# EAGLE design openSX70-dongle_v6-3-dual-led (EAGLE 9.2.2)
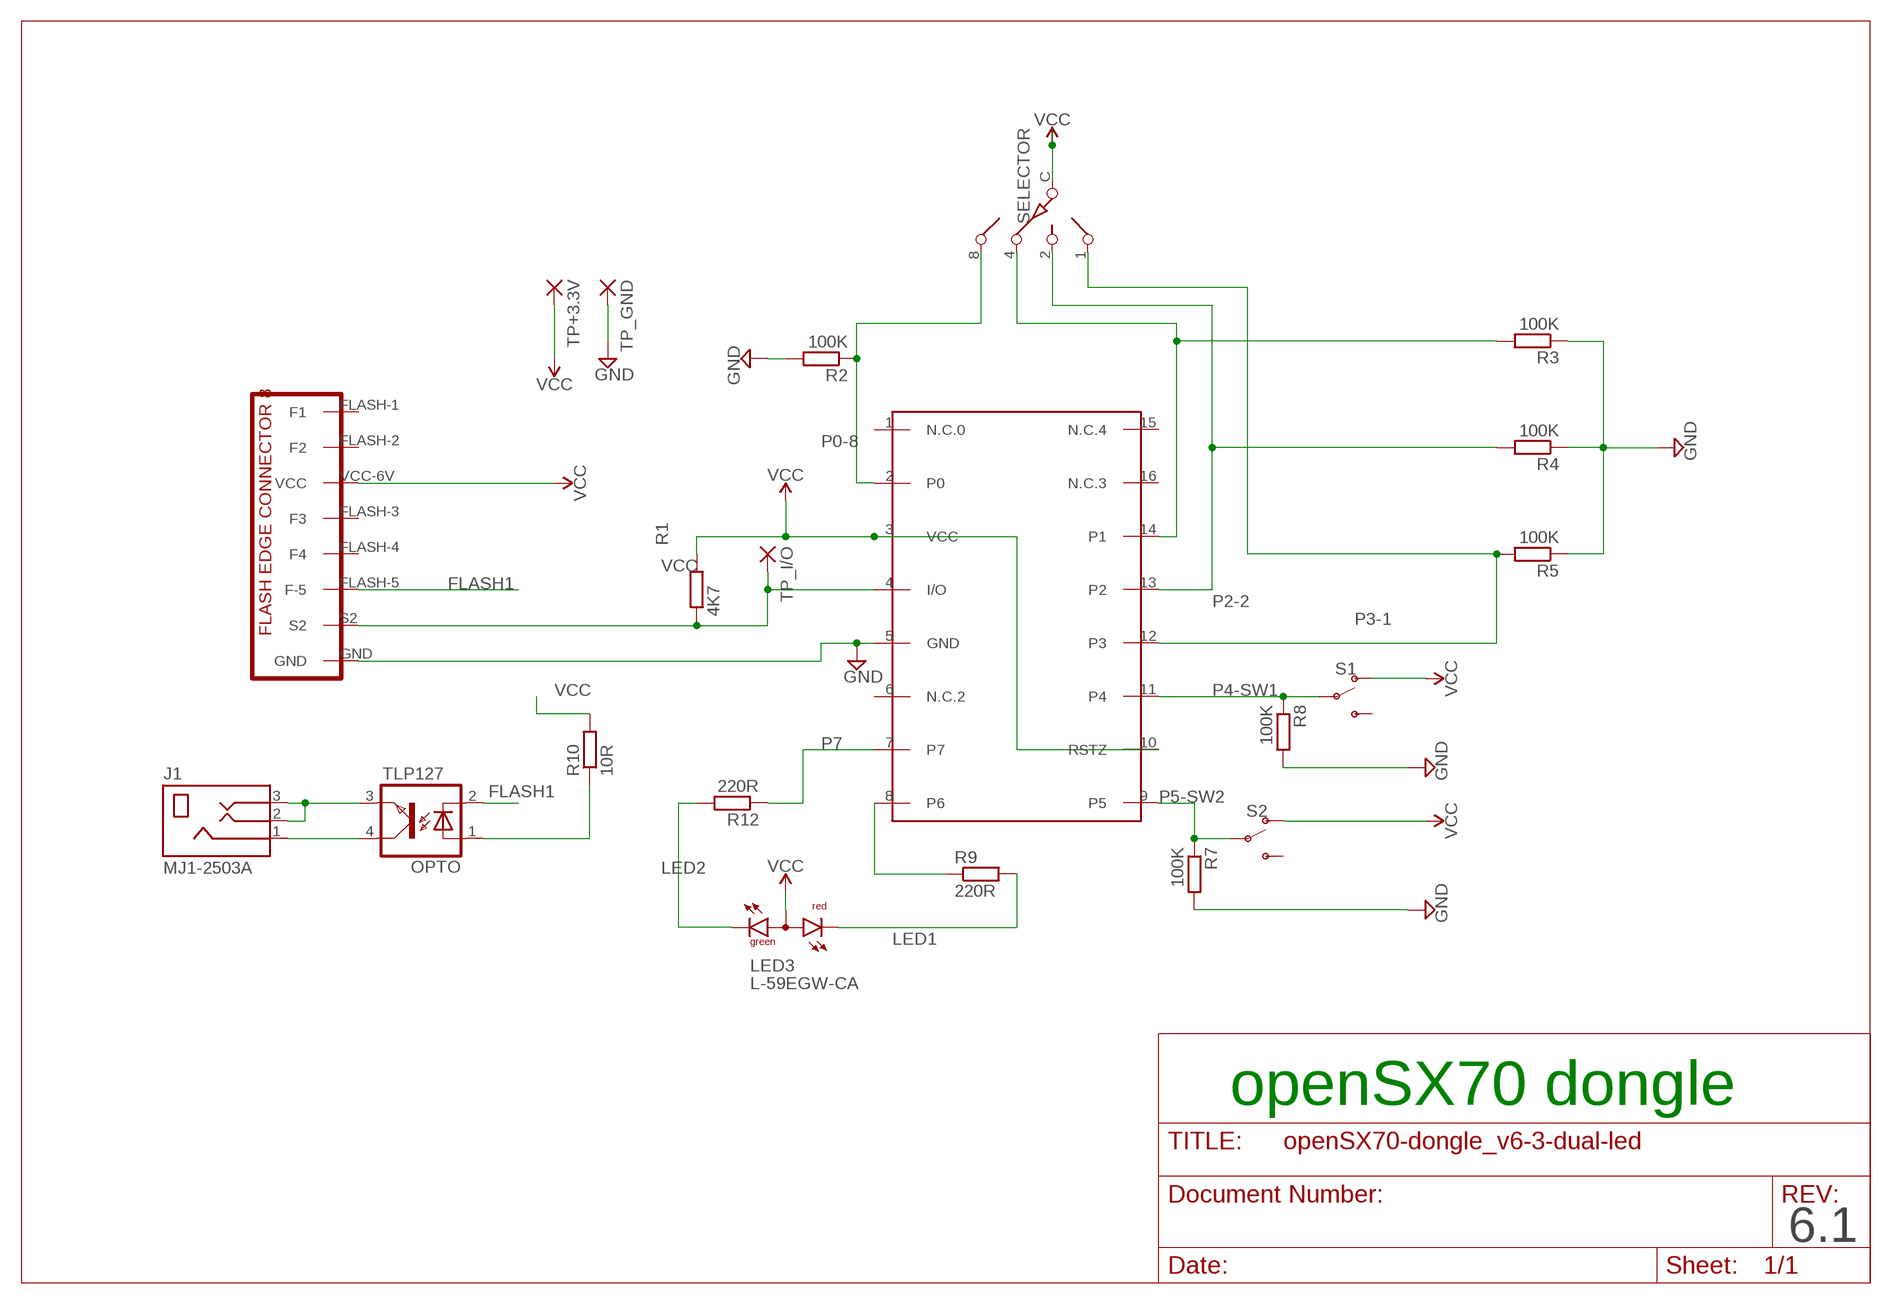
[diagram p0: schematic, sheet 1]

## Parts
DS2408  DS2408  [SO16]
J1  MJ1-2503A  [CUI_MJ1-2503A]
LED3  L-59EGW-CA  [L-59EGW-CA]
OPTO  TLP127  [SO-4]
R1  4K7  R-EU_R0603  [R0603]
R2  100K  R-EU_R0603  [R0603]
R3  100K  R-EU_R0603  [R0603]
R4  100K  R-EU_R0603  [R0603]
R5  100K  R-EU_R0603  [R0603]
R7  100K  R-EU_R0603  [R0603]
R8  100K  R-EU_R0603  [R0603]
R9  220R  R-EU_R0603  [R0603]
R10  10R  R-EU_R0603  [R0603]
R12  220R  R-EU_R0603  [R0603]
S1  SWITCH-SPDT-SMD-RIGHT-ANGLE  [SWITCH_SPST_SMD_A]
S2  SWITCH-SPDT-SMD-RIGHT-ANGLE  [SWITCH_SPST_SMD_A]
SELECTOR  SW-C16  [SW-C16]
TP+3.3V  SMD2  [SMD1,27-2,54]
TP_GND  SMD2  [SMD1,27-2,54]
TP_I/O  SMD2  [SMD1,27-2,54]
U$2  SX70-FLASH-EDGE8-MALE-PROPER  [SX70-FLASH-EDGE8]

## Nets
FLASH1: OPTO.2(C) U$2.FLASH-5(F-5)
GND: DS2408.5(GND) R2.2 R3.1 R4.1 R5.1 R7.2 R8.2 TP_GND.1(P) U$2.GND
LED1: LED3.1(CR) R9.2
LED2: LED3.3(CG) R12.2
N$9: J1.1 OPTO.4(COL)
N$12: OPTO.1(A) R10.1
N$15: J1.2 J1.3 OPTO.3(EMIT)
P0-8: DS2408.2(P0) R2.1 SELECTOR.8
P1-4: DS2408.14(P1) R3.2 SELECTOR.4
P2-2: DS2408.13(P2) R4.2 SELECTOR.2
P3-1: DS2408.12(P3) R5.2 SELECTOR.1
P4-SW1: DS2408.11(P4) R8.1 S1.2(P)
P5-SW2: DS2408.9(P5) R7.1 S2.2(P)
P6: DS2408.8(P6) R9.1
P7: DS2408.7 R12.1
S2+: DS2408.4(I/O) R1.1 TP_I/O.1(P) U$2.S2
VCC: DS2408.3(VCC) DS2408.10(RSTZ) LED3.2(A) R1.2 R10.2 S1.1(O) S2.1(O) SELECTOR.C TP+3.3V.1(P) U$2.VCC-6V(VCC)
Unconnected: DS2408.1(N.C.0) DS2408.6(N.C.2) DS2408.15(N.C.4) DS2408.16(N.C.3) S1.3(S) S2.3(S) U$2.FLASH-1(F1) U$2.FLASH-2(F2) U$2.FLASH-3(F3) U$2.FLASH-4(F4)

## Notes on the sheet
- openSX70 dongle
- 6.1

## Library data of the parts
DS2408 = DS2408-joaco:DS2408
J1 = MJ1-2503A:MJ1-2503A: 2.5 mm, Mono, Right Angle, Through Hole, Audio Jack Connector; CUI_PURCHASE_URL: https://www.cui.com/product/interconnect/connectors/audio-connectors/jacks/mj1-2503a?utm_source=snapeda.com&utm_medium=referral&utm_campaign=snapedaBOM; DESCRIPTION: 2.5 mm, Mono, Right Angle, Through Hole, Audio Jack Connector; DIGI-KEY_PART_NUMBER: CP1-2503AM-ND; DIGI-KEY_PURCHASE_URL: https://www.digikey.com/product-detail/en/cui-inc/MJ1-2503A/CP1-2503AM-ND/738679?utm_source=snapeda&utm_medium=aggregator&utm_campaign=symbol; MF: CUI Inc.; MP: MJ1-2503A; PACKAGE: None
LED3 = led:L-59EGW-CA: T-1 3/4 (5mm) BI-COLOR INDICATOR LAMP Source: http://www.kingbright.com/manager/upload/pdf/L-59EGW-CA%28Ver1292805989.13%29
OPTO = openSX70:TLP127
R1-R5 R7-R9 R12 = rcl:R-EU_: RESISTOR, European symbol; SPICEPREFIX: R
R10 = resistor:R-EU_: RESISTOR, European symbol
S1 S2 = SparkFun-Switches:SWITCH-SPDT: Single Pole, Double Throw (SPDT) Switch Single-pole, double-throw (SPDT) switch. Variant Overview SMD-AYZ0202 Surface Mount DPDT Switch <https://www.sparkfun.com/products/597> (COM-00597) Used on e.g. LilyPad Arduino USB - ATmega32U4 Board <https://www.sparkfun.com/products/12049> PTH-11.6X4.0MM SPDT Mini Power Switch <https://www.sparkfun.com/products/102> (COM-00102) Used on e.g. SparkFun Simon Says - Through-Hole Soldering Kit <https://www.sparkfun.com/products/10547> (KIT-10547) PTH-11.6X4.0MM-KIT KIT version of SPDT Mini Power Switch - Simplifies soldering by removing tStop of switch pins - only one side can be soldered. PTH-11.6X4.0MM-LOCK LOCK version of SPDT Mini Power Switch - Offset pins hold switch in place for easier soldering. SMD-RIGHT-ANGLE Surface Mount Right Angle Switch <https://www.sparkfun.com/products/10860> (COM-10860) Used on e.g. SparkFun ESP8266 Thing <https://www.sparkfun.com/products/13231>; PROD_ID: SWCH-10651; SF_SKU: COM-10860
SELECTOR = special:SW-C16: SWITCH 16-step rotary switch
TP+3.3V TP_GND TP_I/O = wirepad:SMD2: SMD PAD
U$2 = _openSX70:SX70-FLASH-EDGE8-MALE-PROPER

## Net classes
0 GND: width 0.305 mm
1 VCC: width 0.254 mm
2 2.8V: width 0.254 mm

## Board
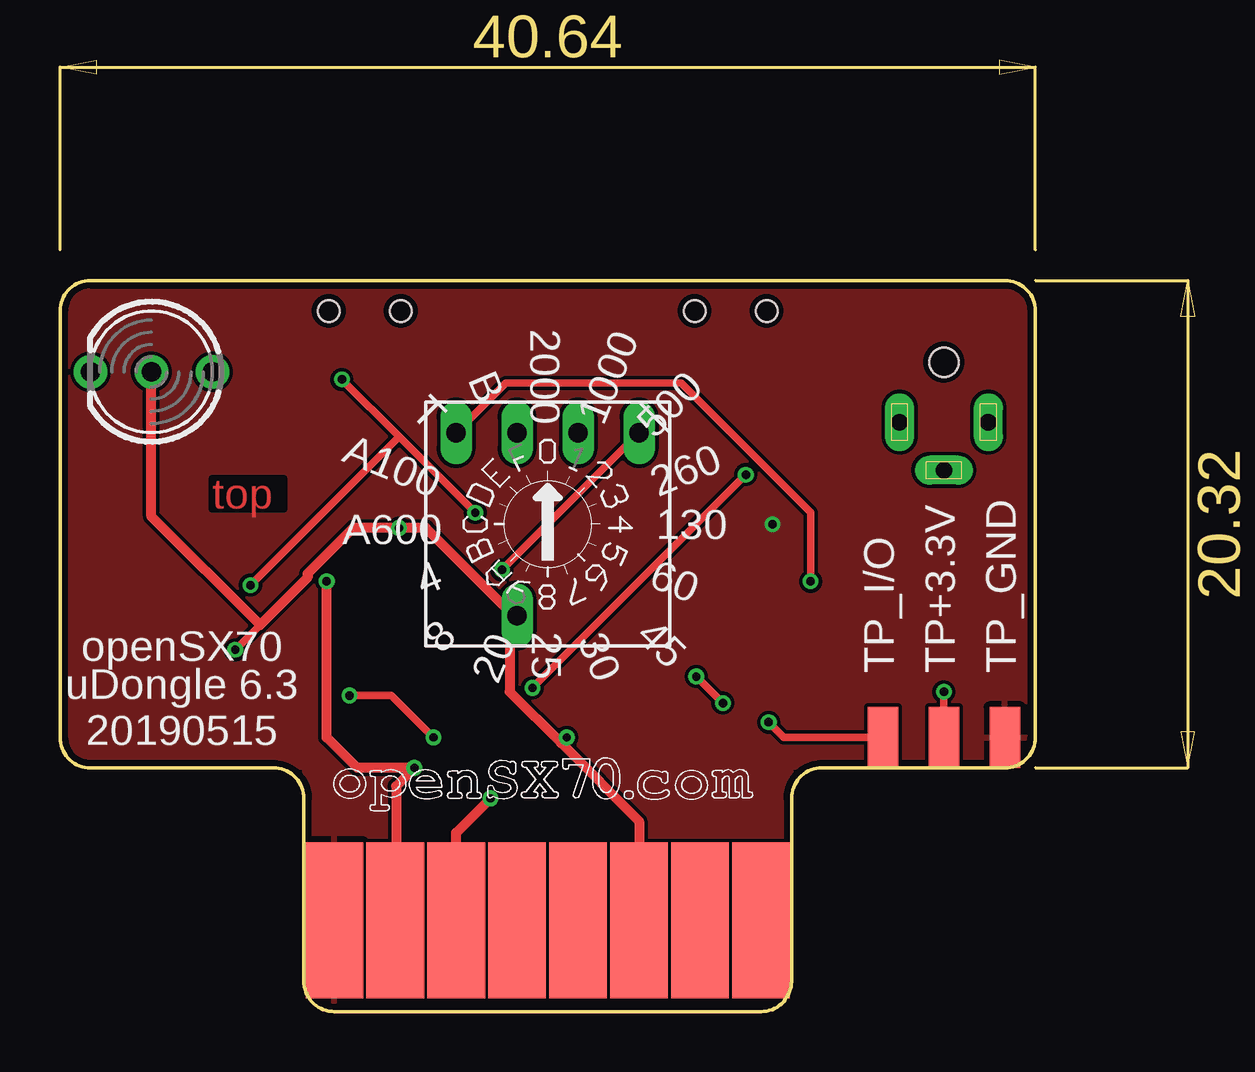
[diagram p1: board, top side]
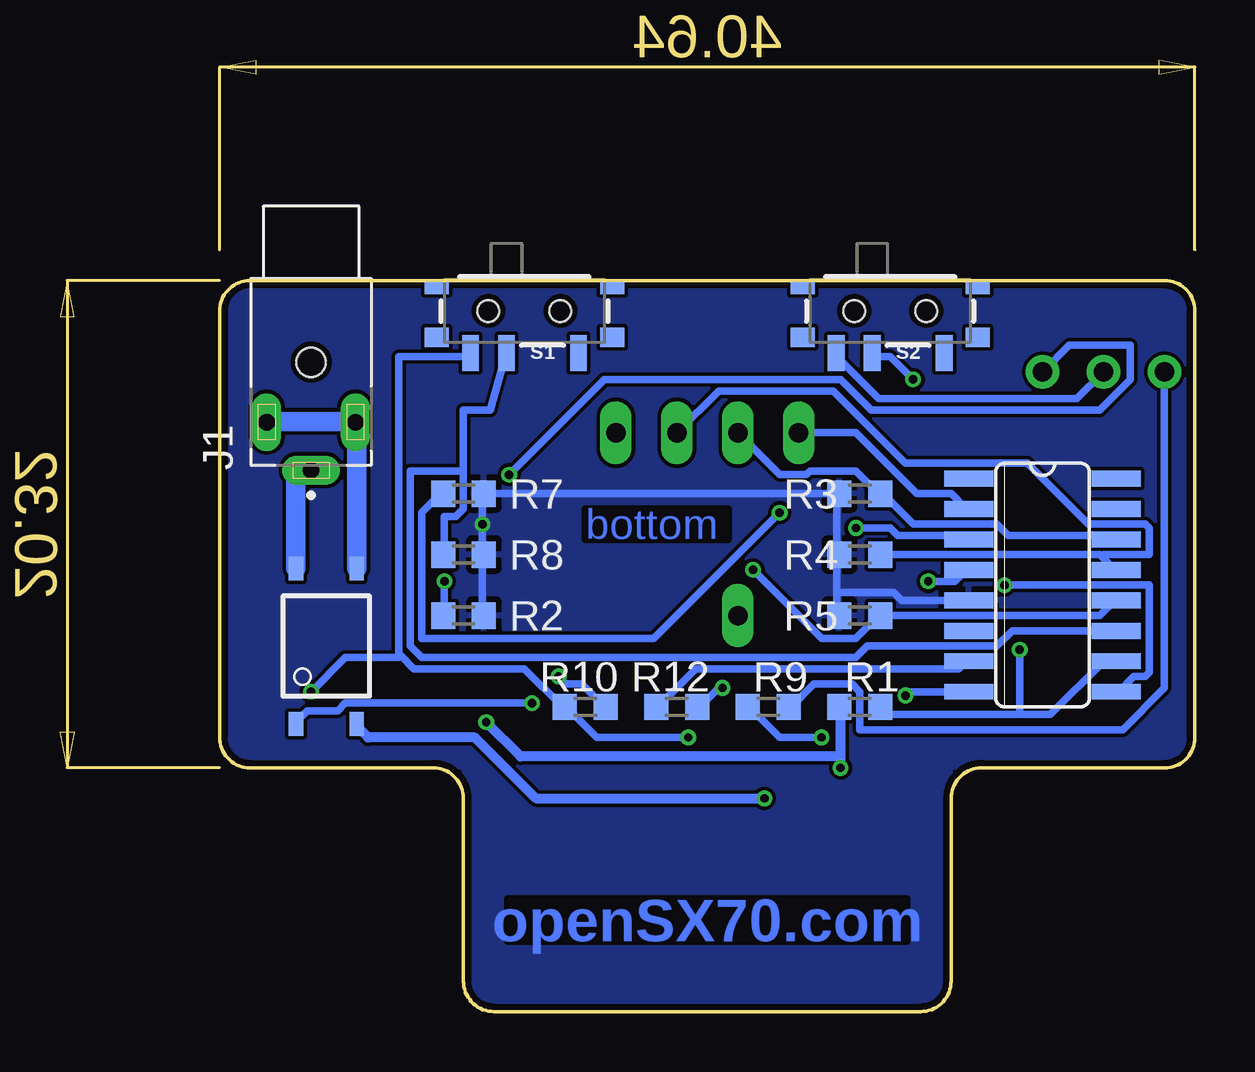
[diagram p2: board, bottom side, seen from below]

Size 40.64 x 30.48 mm. Coordinates in mm from the lower left corner, seen from the top.
Outline: 1.27,30.48 39.37,30.48 arc-90 40.64,29.21 40.64,11.43 arc-90 39.37,10.16 31.75,10.16 arc90 30.48,8.89 30.48,1.27 arc-90 29.21,0 11.43,0 arc-90 10.16,1.27 10.16,8.89 arc90 8.89,10.16 1.27,10.16 arc-90 0,11.43 0,29.21 arc-90 1.27,30.48
Copper layers (1*16): Top 0.035mm / dielectric 1.5mm / Bottom 0.035mm
Design rules "SeeedStudio_2layer_DRU_no_angle_20140221": minimum track width 6mil, minimum drill 12mil, track to track 6mil, track to pad 6mil, pad to pad 6mil, via to via 6mil, smd to smd 0mil, copper to edge 10mil, drill to drill 10mil, minimum pad ring 10mil, minimum via ring 6mil, stop-mask expansion 2mil, vias tented up to drill 100mil, thermal gap 10mil

### Footprints (pad centres in the part's own frame; a part is rotated, then mirrored left to right if it is on the bottom)
SO16 = smd 0.66 x 2.032: 1 -4.445,-3.073; 2 -3.175,-3.073; 3 -1.905,-3.073; 4 -0.635,-3.073; 5 0.635,-3.073; 6 1.905,-3.073; 7 3.175,-3.073; 8 4.445,-3.073; 9 4.445,3.073; 10 3.175,3.073; 11 1.905,3.073; 12 0.635,3.073; 13 -0.635,3.073; 14 -1.905,3.073; 15 -3.175,3.073; 16 -4.445,3.073
CUI_MJ1-2503A = drill 0.7 long: 1 -4.1,0; 2 -2.1,1.85; 3 -2.1,-1.85 | hole 1.2: 0.4,0
L-59EGW-CA = drill 0.8 pad 1.4: 1 0,2.54; 2 0,0; 3 0,-2.54
SO-4 = smd 1 x 0.6: 1 -3.24,0.635; 2 -3.24,-1.905; 3 3.24,-1.905; 4 3.24,0.635
R0603 = smd 1 x 1.1: 1 -0.85,0; 2 0.85,0
SWITCH_SPST_SMD_A = smd 0.7 x 1.5: 1 -2.25,-1.75; 2 -0.75,-1.75; 3 2.25,-1.75 | smd 1 x 0.6: GND1 -3.65,1; GND3 3.65,1 | smd 1 x 0.8: GND2 -3.65,-1.1; GND4 3.65,-1.1 | hole 0.9: -1.5,0; 1.5,0
SW-C16 = drill 0.813 long: 1 -3.81,-3.81; 2 -1.27,-3.81; 4 1.27,-3.81; 8 3.81,-3.81; C 1.27,3.81
SMD1,27-2,54 = smd 1.27 x 2.54: 1 0,0
SX70-FLASH-EDGE8 = smd 2.4 x 6.502: FLASH-1 8.89,0.001; FLASH-2 6.35,0.001; FLASH-3 1.27,0.001; FLASH-4 -1.27,0.001; FLASH-5 -3.81,0.001; GND -8.89,0.001; S2 -6.35,0.001; VCC-6V 3.81,0.001

### Placement (x,y rotation side)
DS2408  6.35,17.78 270 bottom
J1  36.83,26.67 90 bottom
LED3  3.81,26.67 90 top
OPTO  36.83,15.24 90 bottom
R1  13.97,12.7 0 bottom
R2  30.48,16.51 0 bottom
R3  13.97,21.59 0 bottom
R4  13.97,19.05 0 bottom
R5  13.97,16.51 0 bottom
R7  30.48,21.59 0 bottom
R8  30.48,19.05 0 bottom
R9  17.78,12.7 0 bottom
R10  25.4,12.7 180 bottom
R12  21.59,12.7 0 bottom
S1  27.94,29.21 0 bottom
S2  12.7,29.21 0 bottom
SELECTOR  20.32,20.32 180 top
TP+3.3V  36.83,11.43 0 top
TP_GND  39.37,11.43 180 top
TP_I/O  34.29,11.43 0 top
U$2  20.32,3.81 0 top

### Tracks (layer width: path | path; a pad name or v marks a point on that pad's centre or on a via)
FLASH1  (via drill 0.35)
  Top 0.305: 16.51,3.97 U$2.FLASH-5
  Top 0.406: v17.94,8.89 16.51,7.46 16.51,3.97
  Bottom 0.305: 34.92,11.91 OPTO.2
  Bottom 0.406: 34.92,11.91 34.45,11.43 30,11.43 27.46,8.89 v17.94,8.89
GND  (via drill 0.35)
  Bottom 0.305: 29.69,19.05 29.69,16.51 R2.2 | 29.69,19.05 v29.69,20.32 29.69,21.59 R7.2 14.92,21.59 | 29.69,19.05 R8.2 | 14.92,19.05 14.92,17.46 | 14.92,17.46 14.92,16.51 R5.1 | 14.92,19.05 14.92,21.59 | 14.92,19.05 R4.1 | DS2408.5 12.22,17.14 12.54,17.46 14.92,17.46 | 14.92,21.59 R3.1
  pour Bottom: 0,30.48 40.64,30.48 40.64,10.16 30.48,10.16 30.48,0 10.16,0 10.16,10.16 0,10.16
  pour Top: 0,30.48 40.64,30.48 40.64,10.16 30.48,10.16 30.48,0 10.16,0 10.16,10.16 0,10.16
  pour Bottom: 0,30.48 40.64,30.48 40.64,10.16 30.48,10.16 30.48,0 10.16,0 10.16,10.16 0,10.16
LED1
  Bottom 0.305: LED3.1 1.27,13.49 3.02,11.75 13.97,11.75 13.97,13.33 14.29,13.65 15.88,13.65 16.83,12.7 R9.2
LED2  (via drill 0.35)
  Top 0.305: v28.58,22.38 v19.69,13.49
  Bottom 0.305: v19.69,13.49 19.84,13.49 20.64,12.7 R12.2 | v28.58,22.38 24.61,26.35 14.76,26.35 13.49,25.08 3.97,25.08 2.7,26.35 2.7,27.78 5.24,27.78 LED3.3
N$9
  Bottom 0.305: 36.83,22.54 J1.1
  Bottom 0.813: OPTO.4 37.47,22.54 36.83,22.54
N$12  (via drill 0.35)
  Top 0.305: v26.51,13.97 v27.62,12.86
  Bottom 0.305: v27.62,12.86 35.4,12.86 35.72,12.54 36.99,12.54 37.47,12.06 OPTO.1 | v26.51,13.97 26.19,13.65 25.56,13.65 24.61,12.7 R10.1
N$15
  Bottom 0.305: 34.92,24.45 J1.3 35.08,24.61 | 38.58,24.61 J1.2
  Bottom 0.813: 34.92,24.45 OPTO.3 | 35.08,24.61 38.58,24.61
P0-8  (via drill 0.35)
  Top 0.305: v31.27,17.94 31.27,20.8 25.88,26.19 18.57,26.19 SELECTOR.8
  Bottom 0.305: v31.27,17.94 31.27,16.51 R2.1 | SELECTOR.8 14.13,24.13 11.59,21.59 10.16,21.59 9.52,20.96 DS2408.2
P1-4
  Bottom 0.305: SELECTOR.4 17.3,22.38 16.19,22.38 16.03,22.54 14.13,22.54 13.18,21.59 R3.2 13.02,21.59 11.75,20.32 8.25,20.32 7.78,19.84 3.49,19.84 3.33,19.68 DS2408.14
P2-2
  Bottom 0.305: R4.2 3.97,19.05 3.89,18.97 | 3.89,18.97 3.33,18.42 DS2408.13 | SELECTOR.2 19.84,25.88 15.08,25.88 12.06,22.86 6.98,22.86 4.45,20.32 2.06,20.32 1.91,20.16 1.91,19.05 3.81,19.05 3.89,18.97
P3-1  (via drill 0.35)
  Top 0.305: v18.41,18.42 SELECTOR.1
  Bottom 0.305: DS2408.12 3.33,17.14 3.97,16.51 R5.2 13.18,16.51 14.13,15.56 15.56,15.56 v18.41,18.42
P4-SW1
  Bottom 0.305: 30.48,22.54 30.48,25.08 29.36,25.08 S1.2 | 30.48,22.54 30.48,20.96 30.8,20.64 31.27,20.64 31.27,19.05 R8.1 | DS2408.11 7.62,15.87 8.25,15.24 13.65,15.24 14.13,14.76 32.23,14.76 32.7,15.24 32.7,22.54 30.48,22.54
P5-SW2  (via drill 0.35)
  Top 0.305: v11.75,26.35 14.13,23.97 | 14.13,23.97 v17.3,20.8 | 14.13,23.97 v7.94,17.78
  Bottom 0.305: v17.3,20.8 22.54,15.56 32.23,15.56 32.23,20.8 31.43,21.59 R7.1 | v11.75,26.35 12.7,27.3 13.34,27.3 S2.2 | v7.94,17.78 1.91,17.78 1.91,14.13 2.06,13.97 2.54,13.97 3.17,13.33 DS2408.9
P6  (via drill 0.35)
  Top 0.305: v15.56,11.43 13.81,13.18 v12.06,13.18
  Bottom 0.305: v15.56,11.43 17.3,11.43 18.57,12.7 R9.1 | v12.06,13.18 11.91,13.33 DS2408.8
P7
  Bottom 0.305: R12.1 22.38,12.7 20.8,14.29 9.84,14.29 9.52,14.61 DS2408.7
S2+  (via drill 0.35)
  Top 0.305: 14,4 13.97,3.97 U$2.S2 | TP_I/O.1 30.16,11.43 v29.53,12.06
  Top 0.406: 14,4 14,9.4 v14.76,10.16 12.38,10.16 11.11,11.43 v11.11,17.94
  Bottom 0.305: 14.76,12.7 R1.1 | v11.11,17.94 10,17.94 9.52,18.42 DS2408.4
  Bottom 0.406: v14.76,10.16 14.76,10.64 | 14.76,10.64 14.76,12.7 | v29.53,12.06 28.1,10.64 14.76,10.64
VCC  (via drill 0.35)
  Top 0.305: v36.83,13.33 TP+3.3V.1 | SELECTOR.C 18.89,16.51 | 8.33,16.11 v7.3,15.08 | 20.88,11.19 v21.11,11.43
  Top 0.406: 18.89,16.51 15.24,20.16 v14.13,20.16 12.22,20.16 10.32,18.26 10.32,18.1 8.33,16.11 3.81,20.64 LED3.2 | U$2.VCC-6V 24.13,7.94 20.88,11.19 18.73,13.33 18.73,16.51 SELECTOR.C
  Bottom 0.305: 33.1,14.84 33.18,14.92 33.18,27.3 30.32,27.3 S1.1 | 33.1,14.84 32.54,14.29 27.94,14.29 26.35,12.7 R10.2 26.19,12.7 24.92,11.43 v21.11,11.43 | v36.83,13.33 35.4,14.76 33.18,14.76 33.1,14.84 | LED3.2 4.92,25.56 13.18,25.56 14.92,27.3 S2.1 | 7.3,12.38 6.03,12.38 3.81,14.61 DS2408.10 | 7.3,12.38 12.7,12.38 13.02,12.7 R1.2 | v14.13,20.16 12.7,20.16 12.38,19.84 9.68,19.84 9.52,19.68 DS2408.3 | v7.3,15.08 7.3,12.38

### Text on the board
Top: top
Bottom: bottom | openSX70.com
tNames: 60 | 260 | 45 | 500 | 30 | 1000 | 25 | 2000 | 130 | 20 | B | 8 | T | 4 | A100 | A600 | openSX70 | uDongle 6.3 / 20190515